# Altium schematic sheet Power&Vref.SchDoc
size A4; SheetNumber: 3; SheetTotal: 10; SPICEModelCacheUSJFIODM: <root> / <DocumentId>USJFIODM</DocumentId> / <CacheFrame Number="0"> / <Model Name="1050_7443251600_16u" Kind="CKT"> / <Text>******* / .subckt 1050_7443251600_16u 1 2 / Rp 1 2 4256 / Cp 1 2 5.33p / Rs 1 N3 0.0345 / L1 N3 2 16u / .ends 1050_7443251600_16u</Text> / </Model> / </CacheFrame> / </root>
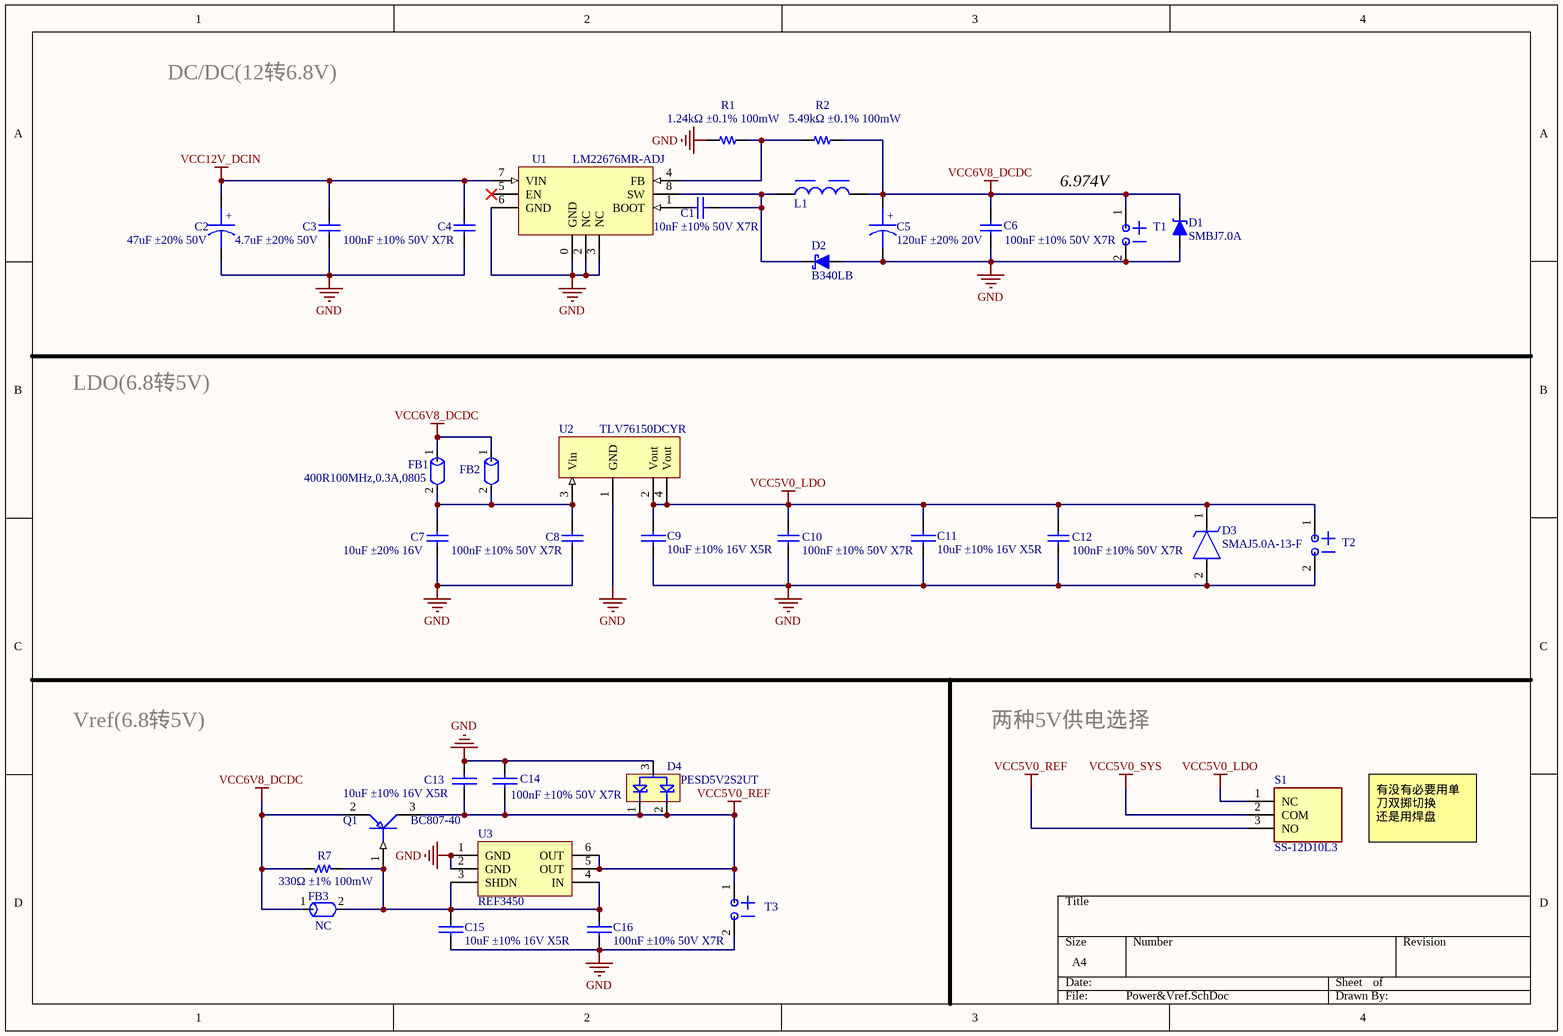
[diagram p0: Power&Vref.SchDoc]

## Parts
C1  10nF ±10% 50V X7R  [C-0603]
C2  47uF ±20% 50V  [CAP-SMD-φ6.3]
C3  4.7uF ±20% 50V  [C-0805]
C4  100nF ±10% 50V X7R  [C-0603]
C5  120uF ±20% 20V  [CAP-SMD-φ6.3]
C6  100nF ±10% 50V X7R  [C-0603]
C7  10uF ±20% 16V  [C-0805]
C8  100nF ±10% 50V X7R  [C-0603]
C9  10uF ±10% 16V X5R  [C-0805]
C10  100nF ±10% 50V X7R  [C-0603]
C11  10uF ±10% 16V X5R  [C-0805]
C12  100nF ±10% 50V X7R  [C-0603]
C13  10uF ±10% 16V X5R  [C-0805]
C14  100nF ±10% 50V X7R  [C-0603]
C15  10uF ±10% 16V X5R  [C-0805]
C16  100nF ±10% 50V X7R  [C-0603]
D1  SMBJ7.0A  [DO-214AA/SMB]
D2  B340LB  [DO-214AA/SMB]
D3  SMAJ5.0A-13-F  [DIOM5226X230N]
D4  PESD5V2S2UT  [sot23-3]
FB1  400R100MHz,0.3A,0805  [R-0805]
FB2  400R100MHz,0.3A,0805  [R-0805]  (value not drawn)
FB3  NC  [R-0805]
L1  16µH, 6.25A  [WE-HCI_1050]  (value not drawn)
Q1  BC807-40  [SOT23-3]
R1  1.24kΩ ±0.1% 100mW  [R-0603]
R2  5.49kΩ ±0.1% 100mW  [R-0603]
R7  330Ω ±1% 100mW  [R-0805]
S1  SS-12D10L3  [SS12D10L3]
T1  POWER_TEST  [BT]  (value not drawn)  (no BOM)
T2  POWER_TEST  [BT]  (value not drawn)  (no BOM)
T3  POWER_TEST  [BT]  (value not drawn)  (no BOM)
U1  LM22676MR-ADJ  [SOIC-8(4.90*3.9)-EPAD]
U2  TLV76150DCYR  [SOT223]
U3  REF3450  [SOT23-6]

## Nets
GND: C2.2 C3.1 C4.1 C5.2 C6.1 C7.1 C8.1 C9.1 C10.1 C11.1 C12.1 C13.1 C14.2 C15.1 C16.1 D1.A D2.A D3.2(A) D4.3 R1.1(TOP) T1.2(-) T2.2(-) T3.2(-) U1.0(GND) U1.2(NC) U1.3(NC) U1.6(GND) U2.1(GND) U3.1(GND) U3.2(GND)
VCC5V0_LDO: C9.2 C10.2 C11.2 C12.2 D3.1(K) S1.1(NC) T2.1(+) U2.2(Vout) U2.4(Vout)
VCC5V0_REF: C13.2 C14.1 D4.1 D4.2 Q1.3(C) S1.3(NO) T3.1(+) U3.5(OUT) U3.6(OUT)
VCC5V0_SYS: S1.2(COM)
VCC6V8_DCDC: C5.1 C6.2 D1.K FB1.1 FB2.1 FB3.1 L1.2 Q1.2(E) R2.1(TOP) R7.2(BOT) T1.1(+)
VCC12V_DCIN: C2.1 C3.2 C4.2 U1.7(VIN)
NetC1_1: C1.1 D2.K L1.1 U1.8(SW)
NetC1_2: C1.2 U1.1(BOOT)
NetC7_2: C7.2 C8.2 FB1.2 FB2.2 U2.3(Vin)
NetC15_2: C15.2 C16.2 FB3.2 Q1.1(B) R7.1(TOP) U3.3(SHDN) U3.4(IN)
NetR1_2: R1.2(BOT) R2.2(BOT) U1.4(FB)

Not connected (* = marked no-connect by the designer): U1 5(EN)*

## Notes on the sheet
- DC/DC(12转6.8V)
- (near T1) 6.974V
- LDO(6.8转5V)
- Vref(6.8转5V)
- 两种5V供电选择
- 有没有必要用单刀双掷切换
  还是用焊盘
- (in symbol 10uF/16V贴片铝电解) +
- (in symbol 100uF/25V贴片铝电解) +

## Library data of the parts
C1 = 10nF_1: 贴片瓷介电容10nF±10%,0805; 物料编号: 210001895; 详细描述: X7R,50V,三星CL21B103KBANNNC; 版本: V1.00; 名称: 贴片瓷介电容10nF±10%,0805; 制造商: *
C2 = 10uF/16V贴片铝电解: EEEFT1H470AP; 版本: V1.00; 名称: 贴片铝电解电容10uF/16V; 物料编号: APLLY; 详细描述: 4.0mm X 5.3mm 体积，贴片铝电解电容10uF/16V; 制造商: TBD
C3 C7 = C-1210
C4 C6 C8 C10 C12 = 100nF_1: 物料编号: 210001894; 详细描述: X7R,50V,三星CL21B104JBCNNNC; 版本: V1.00; 名称: 贴片瓷介电容100nF±5%,0805; 制造商: 三星
C5 = 100uF/25V贴片铝电解: 名称: 贴片铝电解电容100uF/25V; 版本: V1.00; 详细描述: 6.3mm X 7.7mm体积，贴片铝电解电容100uF/25V; 制造商: TBD; 物料编号: APPLY
C9 C11 C13 C15 = CAP: Capacitor
C14 C16 = CAP
D1 = Diode-稳压-213AB/LL34/MiniMELF: 厂家: *; 物料名称: *; 物料编号: *; 详细描述: *
D2 = Diode-肖特基-214AA  (SMB): 版本: V1.00; 物料编号: APLLY; 详细描述: 贴片，二极管
D3 = SMAJ5.0A-13-F: TVS Diode (Uni-directional); Manufacturer_Name: Diodes Incorporated; Datasheet Link: https://componentsearchengine.com/Datasheets/2/SMAJ5.0A-13-F.pdf; Height: 2.3mm; Manufacturer_Part_Number: SMAJ5.0A-13-F; Mouser Part Number: 621-SMAJ5.0A-13-F; Mouser Price/Stock: https://www.mouser.co.uk/ProductDetail/Diodes-Incorporated/SMAJ5.0A-13-F?qs=gaDBXWSqsDCr%2F5d1gQdliw%3D%3D; Arrow Part Number: SMAJ5.0A-13-F; Arrow Price/Stock: https://www.arrow.com/en/products/smaj5.0a-13-f/diodes-incorporated?region=europe
D4 = PESDxS2UT
FB1-FB3 = FB_1K/500mA_0805: Rdc0.3Ω,伍尔特,742792032; 名称: 贴片磁珠1K/500mA，0805; 版本: V1.00; 物料编号: 210001925; 详细描述: Rdc0.3,R材料,TDK MMZ2012R102A; 制造商: TDK
L1 = 7443251600: WE-HCI SMT Flat Wire High Current Inductor, size 1050, 16µH, 6.25A, 34.5mΩ; Manufacturer: Wurth Elektronik; Case/Size Code: 1050; Material: Superflux; Saturation Current: 6.5A; Self Resonant Frequency: 18MHz; Manufacturer Part Number: 7443251600; Category: Shielded Power Inductors; Match Code: WE-HCI; ComponentLink1Description: Website Link; ComponentLink1URL: https://www.we-online.com/redexpert/article/7443251600?ad; ComponentLink2Description: Datasheet Link; ComponentLink2URL: https://www.we-online.com/redexpert/spec/7443251600?ad; Mount: Surface Mount; Operating Temperature Max: 150°C; Operating Temperature Min: -40°C; Packaging: Tape and Reel; Length: 10.2mm; Width: 10.2mm; Height: 4.7mm; DC Resistance: 34.5mΩ; Inductance: 16µH; Performance Rated Current: 6.25A
Q1 = BC807-40: 版本: V1.00; 物料编号: *; 详细描述: *
R1 = 3.3K_1: 国巨RC0805FR-073K3; 物料编号: 210001835; 详细描述: 0805,1/8W,国巨RC0805FR-073K3; 制造商: 国巨; 版本: V1.00; 名称: 贴片电阻3.3K±1%
R2 = 10K_1: RT0603BRD075K49L; 版本: V1.00; 名称: 贴片电阻10K±1%; 物料编号: 210001830; 详细描述: 0805,1/8W,国巨RC0805FR-0710K; 制造商: 国巨
R7 = 100Ω_1: 国巨RC0805FR-07100R; 物料编号: 210000765; 详细描述: 0805,1/8W,国巨RC0805FR-07100R; 制造商: 国巨; 版本: V1.00; 名称: 贴片电阻100±1%
S1 = SS-12D10L3: Switch; Manufacturer_Name: XKB Connectivity; Datasheet Link: http://www.helloxkb.com/public/images/pdf/SS-12D10XXX.pdf; Height: 9.6mm; Manufacturer_Part_Number: SS-12D10L3
U1 = LM22676MR-ADJ: 版本: V1.00; 名称: 芯片LM22676MR-ADJ; 详细描述: N沟道MOS管，输出电压可调，电流3A，; 制造商: NS; 物料编号: APPLY
U2 = LM1117IMP-3.3/NOPB: 品牌：TI，型号：LM1117IMP-3.3/NOPB，800-mA Low-Dropout，SOT223，-40~+ 125°C，ROHS
U3 = REF3225